# EAGLE schematic MicrocontrollerModule (EAGLE 6.3)
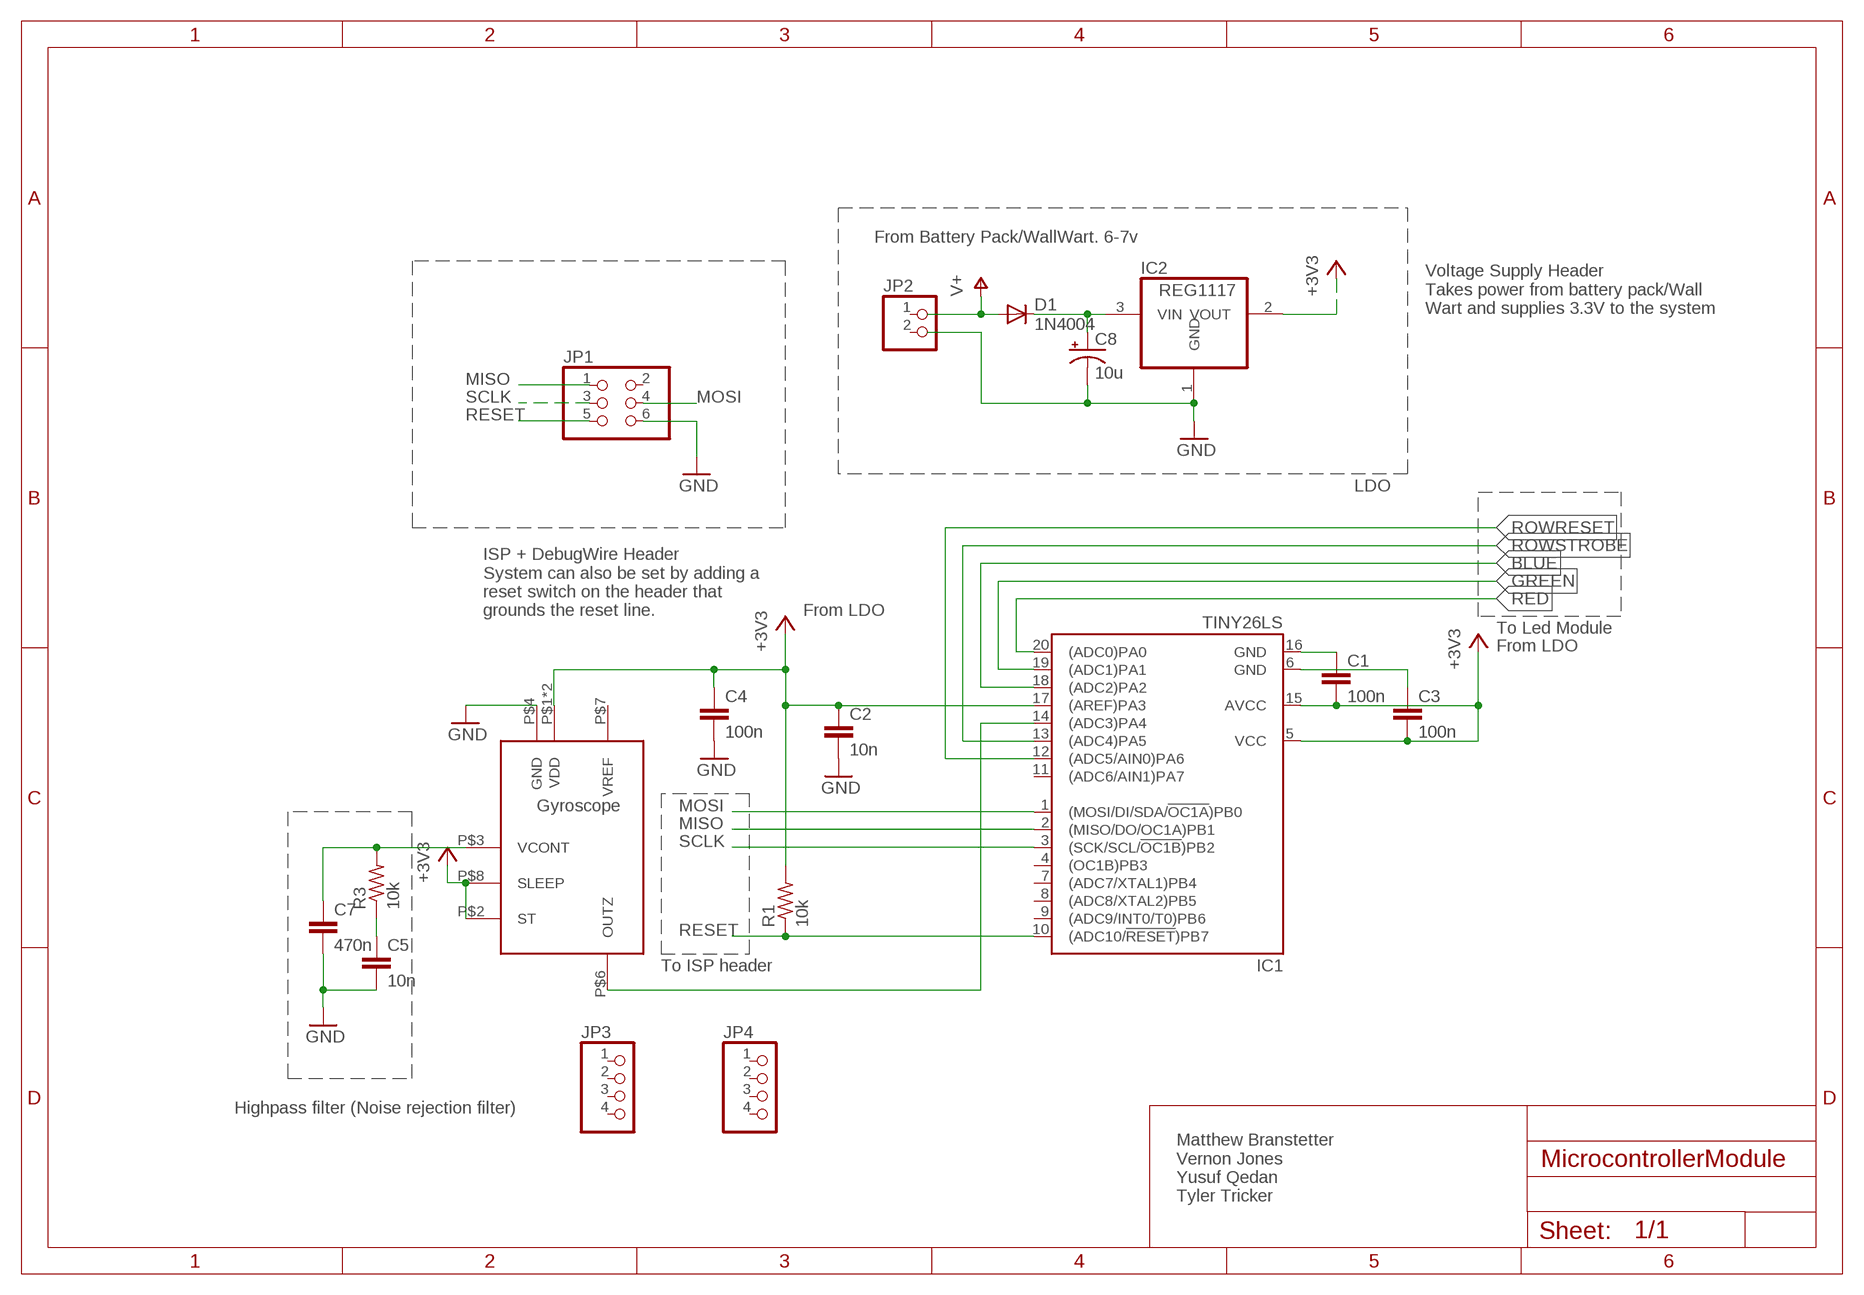
[diagram p0: schematic, sheet 1]

## Parts
C1  100n  C-EUC1210  [C1210]
C2  10n  C-EUC1210  [C1210]
C3  100n  C-EUC1210  [C1210]
C4  100n  C-EUC1210  [C1210]
C5  10n  C-EUC1210  [C1210]
C7  470n  C-EUC1210  [C1210]
C8  10u  CPOL-US153CLV-0605  [153CLV-0605]
D1  1N4004  [DO41-10]
IC1  TINY26LS  [SO20L]
IC2  REG1117  [SOT223]
JP1  PINHD-2X3  [2X03]
JP2  PINHD-1X2  [1X02]
JP3  PINHD-1X4  [1X04]
JP4  PINHD-1X4  [1X04]
R1  10k  R-US_M2012  [M2012]
R3  10k  R-US_M2012  [M2012]
U$1  LY3200ALHLY3200ALH-LGA10  [LGA10]

## Nets
+3V3: C1.2 C2.1 C3.2 C4.1 IC1.5(VCC) IC1.15(AVCC) IC1.17((AREF)PA3) IC2.2(VOUT) R1.2 U$1.P$1(VDD) U$1.P$2(ST) U$1.P$8(SLEEP) U$1.P$9(VDD)
BLUE: IC1.18((ADC2)PA2)
GND: C2.2 C4.2 C5.2 C7.2 C8.- IC2.1(GND) JP1.6 U$1.P$4(GND)
GREEN: IC1.19((ADC1)PA1)
MISO: IC1.2((MISO/DO/OC1A)PB1) JP1.1
MOSI: IC1.1((MOSI/DI/SDA/!OC1A!)PB0) JP1.4
N$1: C5.1 R3.1
N$2: C1.1 IC1.16(GND)
N$3: C3.1 IC1.6(GND)
N$4: C8.+ D1.C IC2.3(VIN)
N$5: C7.1 R3.2 U$1.P$3(VCONT)
N$6: IC1.14((ADC3)PA4) U$1.P$6(OUTZ)
RED: IC1.20((ADC0)PA0)
RESET: IC1.10((ADC10/!RESET!)PB7) JP1.5 R1.1
ROWRESET: IC1.12((ADC5/AIN0)PA6)
ROWSTROBE: IC1.13((ADC4)PA5)
SCLK: IC1.3((SCK/SCL/!OC1B!)PB2) JP1.3
V+: D1.A
Unconnected: IC1.4((OC1B)PB3) IC1.7((ADC7/XTAL1)PB4) IC1.8((ADC8/XTAL2)PB5) IC1.9((ADC9/INT0/T0)PB6) IC1.11((ADC6/AIN1)PA7) JP1.2 JP2.1 JP2.2 JP3.1 JP3.2 JP3.3 JP3.4 JP4.1 JP4.2 JP4.3 JP4.4 U$1.P$7(VREF)

## Notes on the sheet
- From Battery Pack/WallWart. 6-7v
- Voltage Supply Header
  Takes power from battery pack/Wall
  Wart and supplies 3.3V to the system
- LDO
- ISP + DebugWire Header
  System can also be set by adding a
  reset switch on the header that
  grounds the reset line.
- From LDO
- To Led Module
- From LDO
- Gyroscope
- To ISP header
- Highpass filter (Noise rejection filter)
- Matthew Branstetter
  Vernon Jones
  Yusuf Qedan
  Tyler Tricker

## Library data of the parts
C1-C5 C7 = resistor:C-EU: CAPACITOR, European symbol
C8 = rcl:CPOL-US: POLARIZED CAPACITOR, American symbol
D1 = diode:1N4004: DIODE general purpose rectifier, 1 A
IC1 = atmel:TINY26*: 8-bit AVR Microcontroller with 2K Bytes Flash Source: http://www.atmel.com .. doc1477.pdf; MPN: ATTINY26L-8SU; OC_FARNELL: 9171665; OC_NEWARK: 01M6921
IC2 = burr-brown:REG1117: 800mA and 1A Low Dropout (LDO) Positive Regulator 1.8V, 2.5V, 2.85V, 3.3V, 5V, and Adj; MPN: REG1117; OC_FARNELL: 1097566; OC_NEWARK: 14P6981
JP1 = pinhead:PINHD-2X3: PIN HEADER
JP2 = pinhead:PINHD-1X2: PIN HEADER
JP3 JP4 = pinhead:PINHD-1X4: PIN HEADER
R1 R3 = resistor:R-US_: RESISTOR, American symbol
U$1 = symbols:LY3200ALH: MEMS motion sensor: high performance ±2000 dps analog yaw-rate gyroscope